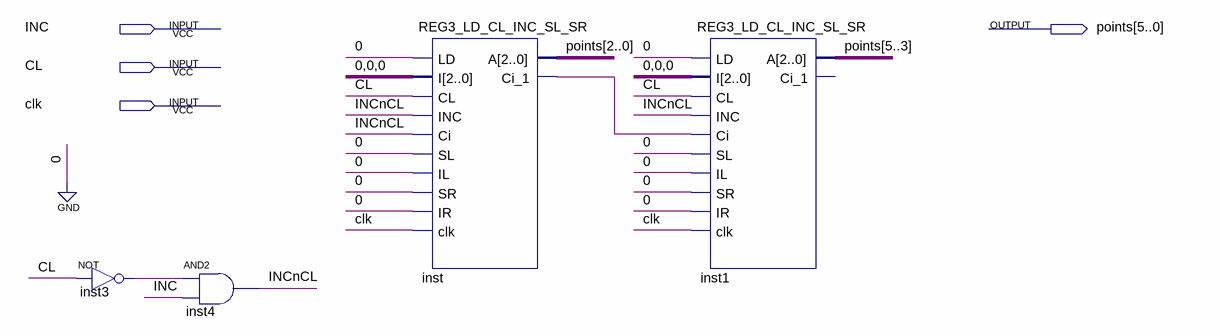
[diagram p0: schematic sheet]
// Quartus schematic main2.bdf as structural Verilog: 4 symbols, 4 pins
module main2 (
  input  INC,
  input  CL,
  input  clk,
  output [5:0] points
);

  wire INCnCL, inst3_out, inst_ci_1;

  not inst3 (inst3_out, CL);
  and inst4 (INCnCL, inst3_out, INC);
  REG3_LD_CL_INC_SL_SR inst (
    .LD(1'b0), .I(3'b000), .CL(CL), .INC(INCnCL), .Ci(INCnCL), .SL(1'b0), .IL(1'b0), .SR(1'b0), .IR(1'b0),
    .clk(clk), .A(points[2:0]), .Ci_1(inst_ci_1));
  REG3_LD_CL_INC_SL_SR inst1 (
    .LD(1'b0), .I(3'b000), .CL(CL), .INC(INCnCL), .Ci(inst_ci_1), .SL(1'b0), .IL(1'b0), .SR(1'b0), .IR(1'b0),
    .clk(clk), .A(points[5:3]));  // open: Ci_1
endmodule
